# Altium schematic sheet 01_Power_Protection.SchDoc: POWER
size A4; DrawnBy: YILDIRIM_DOGRU
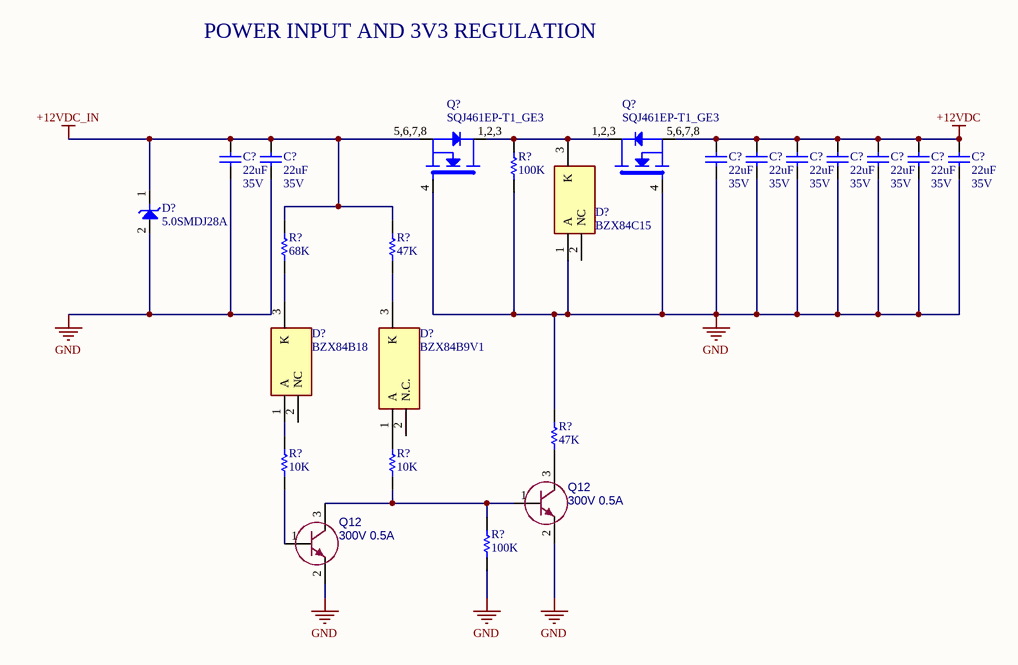
[diagram p0: 01_Power_Protection.SchDoc]

## Parts
(Parts that share a designator on the sheet are numbered #1, #2 ... from top to bottom, then left to right.)
C?#1  value 22uF  Voltage: 35V  [CAP_0805]  (hidden comment: GMC21X5R226M35NT)
C?#2  value 22uF  Voltage: 35V  [CAP_0805]  (hidden comment: GMC21X5R226M35NT)
C?#3  value 22uF  Voltage: 35V  [CAP_0805]  (hidden comment: GMC21X5R226M35NT)
C?#4  value 22uF  Voltage: 35V  [CAP_0805]  (hidden comment: GMC21X5R226M35NT)
C?#5  value 22uF  Voltage: 35V  [CAP_0805]  (hidden comment: GMC21X5R226M35NT)
C?#6  value 22uF  Voltage: 35V  [CAP_0805]  (hidden comment: GMC21X5R226M35NT)
C?#7  value 22uF  Voltage: 35V  [CAP_0805]  (hidden comment: GMC21X5R226M35NT)
C?#8  value 22uF  Voltage: 35V  [CAP_0805]  (hidden comment: GMC21X5R226M35NT)
C?#9  value 22uF  Voltage: 35V  [CAP_0805]  (hidden comment: GMC21X5R226M35NT)
D?#1  5.0SMDJ28A  [SMCJ58A]
D?#2  BZX84C15  [SOT95P240X120-3N]
D?#3  BZX84B18  [SOT95P240X110-3N]
D?#4  BZX84B9V1  [SOT95P240X110-3N]
Q12#1  value 300V 0.5A  [SOT-23-3]  (hidden comment: MMBTA42_R1_00001)
Q12#2  value 300V 0.5A  [SOT-23-3]  (hidden comment: MMBTA42_R1_00001)
Q?#1  SQJ461EP-T1_GE3  [SOT323]
Q?#2  SQJ461EP-T1_GE3  [SOT323]
R?#1  value 100K  [RES_0402]  (hidden comment: 0402WGF1003TCE)
R?#2  value 68K  [RES_0402]  (hidden comment: 0402WGF6802TCE)
R?#3  value 47K  [RES_0603]  (hidden comment: 0603SAF4702T5E)
R?#4  value 47K  [RES_0603]  (hidden comment: 0603SAF4702T5E)
R?#5  value 10K  [RES_0402]  (hidden comment: RC0402JR-0710KL)
R?#6  value 10K  [RES_0402]  (hidden comment: RC0402JR-0710KL)
R?#7  value 100K  [RES_0402]  (hidden comment: 0402WGF1003TCE)

## Nets
+12VDC: C?#3.1 C?#4.1 C?#5.1 C?#6.1 C?#7.1 C?#8.1 C?#9.1 Q?#2.5,6,7,8(S)
+12VDC_IN: C?#1.1 C?#2.1 D?#1.1 Q?#1.5,6,7,8(S) R?#2.2 R?#3.2
GND: C?#1.2 C?#2.2 C?#3.2 C?#4.2 C?#5.2 C?#6.2 C?#7.2 C?#8.2 C?#9.2 D?#1.2 D?#2.1(A) Q12#1.2(E) Q12#2.2(E) Q?#1.4(G) Q?#2.4(G) R?#1.1 R?#4.2 R?#7.1
NetD?#2_3: D?#2.3(K) Q?#1.1,2,3(D) Q?#2.1,2,3(D) R?#1.2
NetD?#3_1: D?#3.1(A) R?#5.2
NetD?#3_3: D?#3.3(K) R?#2.1
NetD?#4_1: D?#4.1(A) R?#6.2
NetD?#4_3: D?#4.3(K) R?#3.1
NetQ12#1_1: Q12#1.1(B) Q12#2.3(C) R?#6.1 R?#7.2
NetQ12#1_3: Q12#1.3(C) R?#4.1
NetQ12#2_1: Q12#2.1(B) R?#5.1

Not connected (* = marked no-connect by the designer): D?#2 2(NC); D?#3 2(NC); D?#4 2(N.C.)

## Notes on the sheet
- POWER INPUT AND 3V3 REGULATION
- Title
- Size:
- Date:
- A4
- Drawn By:
- Number:
- Revision:
- File:

## Library data of the parts
C?#1-C?#9 = C01758: 22 µF ±20% 35V Ceramic Capacitor X5R 0805 (2012 Metric); Manufacturer: Cal-Chip Electronics, Inc.; Manufacturer Part Number: GMC21X5R226M35NT
D?#1 = 5.0SMDJ28A: 45.4V Clamp 110A Ipp Tvs Diode Surface Mount DO-214AB (SMC); Manufacturer: Bourns Inc.; Datasheet Link: https://www.diodes.com/part/view/SMCJ58A; Height: 2.5mm; Manufacturer Part Number: 5.0SMDJ28A; Mouser Part Number: N/A; Mouser Price/Stock: https://www.mouser.co.uk/ProductDetail/Diodes-Incorporated/SMCJ58A?qs=evjyFmOIEsnFZCuxUMyzBg%3D%3D
D?#2 = BZX84C15: Zener Diode; Manufacturer: Diotec; Manufacturer Part Number: BZX84C15
D?#3 = BZX84B18: Zener Diode; Manufacturer: PANJIT; Manufacturer Part Number: BZX84B18
D?#4 = BZX84B9V1: Zener Diode; Manufacturer: PANJIT; Manufacturer Part Number: BZX84B9V1
Q12#1 Q12#2 = MMBTA42_R1_00001: TRANSISTOR DIS.500mA 300V NPN SOT23 GEN. SMT; Manufacturer: PANJIT; Package: SOT23; Supplier Part Number 1: 3757-MMBTA42_R1_00001CT-ND; Supplier Part Number 2: *; Supplier Part Number 3: MMBTA42_R1_00001; Supplier 1: DIGIKEY; Supplier 2: MOUSER; Supplier 3: OZDISAN; Manufacturer Part Number: MMBTA42_R1_00001
Q?#1 Q?#2 = SQJ461EP-T1_GE3: P-Channel 60 V 30A (Tc) 83W (Tc) Surface Mount PowerPAK® SO-8; Manufacturer: Vishay Siliconix; Value: *; Supplier 1: OZDISAN; Manufacturer Part Number: SQJ461EP-T1_GE3
R?#1 R?#7 = R03000: RES.(1005) 0402 100K Ohms 1% 1/16W 100PPM; Manufacturer: ROYALOHM; Manufacturer Part Number: 0402WGF1003TCE
R?#2 = R03000: RES.(1005) 0402 68K Ohms 1% 1/16W 100PPM; Manufacturer: ROYALOHM; Manufacturer Part Number: 0402WGF6802TCE
R?#3 R?#4 = 0603SAF4702T5E: RES.(1608) 0603 47K Ohms 1% 1/10W-S 100PPM; Manufacturer: ROYALOHM; Supplier 1: Ozdisan; Manufacturer Part Number: 0603SAF4702T5E
R?#5 R?#6 = R03000: RES.(1005) 0402 10K Ohms 5% 1/16W 100PPM SMT; Manufacturer: YAGEO; Manufacturer Part Number: RC0402JR-0710KL